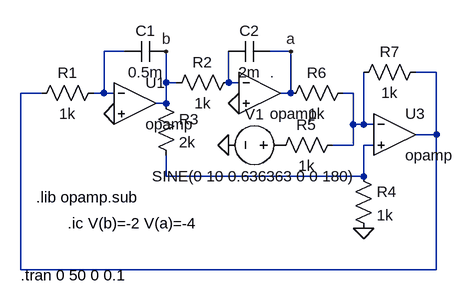
[diagram p0: schematic circuit.asc]
circuit.asc, the LTspice schematic file:
Version 4
SHEET 1 880 680
WIRE 176 16 144 16
WIRE 432 16 400 16
WIRE 656 48 624 48
WIRE 240 64 240 16
WIRE 256 64 240 64
WIRE 336 64 336 16
WIRE 352 64 336 64
WIRE 48 80 16 80
WIRE 144 80 144 16
WIRE 144 80 128 80
WIRE 160 80 144 80
WIRE 432 80 432 16
WIRE 432 80 416 80
WIRE 528 80 512 80
WIRE 240 96 240 64
WIRE 240 96 224 96
WIRE 528 128 528 80
WIRE 544 128 544 48
WIRE 544 128 528 128
WIRE 560 128 544 128
WIRE 656 144 656 48
WIRE 656 144 624 144
WIRE 528 160 528 128
WIRE 528 160 496 160
WIRE 560 160 544 160
WIRE 240 208 240 176
WIRE 544 208 544 160
WIRE 544 208 240 208
WIRE 16 352 16 80
WIRE 656 352 656 144
WIRE 656 352 16 352
FLAG 336 160 0
FLAG 544 288 0
FLAG 160 112 0
FLAG 352 96 0
FLAG 240 16 b
FLAG 432 16 a
SYMBOL Opamps\\opamp 192 32 R0
SYMATTR InstName U1
SYMBOL res 144 64 R90
WINDOW 0 0 56 VBottom 2
WINDOW 3 32 56 VTop 2
SYMATTR InstName R1
SYMATTR Value 1k
SYMBOL cap 240 0 R90
WINDOW 0 0 32 VBottom 2
WINDOW 3 32 32 VTop 2
SYMATTR InstName C1
SYMATTR Value 0.5m
SYMBOL Opamps\\opamp 384 16 R0
SYMATTR InstName .
SYMBOL res 352 48 R90
WINDOW 0 0 56 VBottom 2
WINDOW 3 32 56 VTop 2
SYMATTR InstName R2
SYMATTR Value 1k
SYMBOL cap 400 0 R90
WINDOW 0 0 32 VBottom 2
WINDOW 3 32 32 VTop 2
SYMATTR InstName C2
SYMATTR Value 2m
SYMBOL Opamps\\opamp 592 80 R0
SYMATTR InstName U3
SYMBOL voltage 432 160 M270
WINDOW 0 32 56 VTop 2
WINDOW 3 -32 56 VBottom 2
WINDOW 123 0 0 Left 2
WINDOW 39 0 0 Left 2
SYMATTR InstName V1
SYMATTR Value SINE(0 10 0.636363 0 0 180)
SYMBOL res 512 144 R90
WINDOW 0 0 56 VBottom 2
WINDOW 3 32 56 VTop 2
SYMATTR InstName R5
SYMATTR Value 1k
SYMBOL res 528 64 R90
WINDOW 0 0 56 VBottom 2
WINDOW 3 32 56 VTop 2
SYMATTR InstName R6
SYMATTR Value 1k
SYMBOL res 640 32 R90
WINDOW 0 0 56 VBottom 2
WINDOW 3 32 56 VTop 2
SYMATTR InstName R7
SYMATTR Value 1k
SYMBOL res 224 80 R0
SYMATTR InstName R3
SYMATTR Value 2k
SYMBOL res 528 192 R0
SYMATTR InstName R4
SYMATTR Value 1k
TEXT 40 240 Left 2 !.lib opamp.sub
TEXT 16 360 Left 2 !.tran 0 50 0 0.1
TEXT 88 280 Left 2 !.ic V(b)=-2 V(a)=-4

The netlist it stands for:
* circuit.asc
XU1 N001 0 b opamp Aol=100K GBW=10Meg  ; pins invin noninvin out
R1 N001 N002 1k
C1 b N001 0.5m
X. N003 0 a opamp Aol=100K GBW=10Meg  ; pins invin noninvin out
R2 N003 b 1k
C2 a N003 2m
XU3 N004 N005 N002 opamp Aol=100K GBW=10Meg  ; pins invin noninvin out
V1 P001 0 SINE(0 10 0.636363 0 0 180)
R5 N004 P001 1k
R6 N004 a 1k
R7 N002 N004 1k
R3 b N005 2k
R4 N005 0 1k
.lib opamp.sub
.tran 0 50 0 0.1
.ic V(b)=-2 V(a)=-4
.backanno
.end